# Altium schematic sheet RowSingle.SchDoc
size A
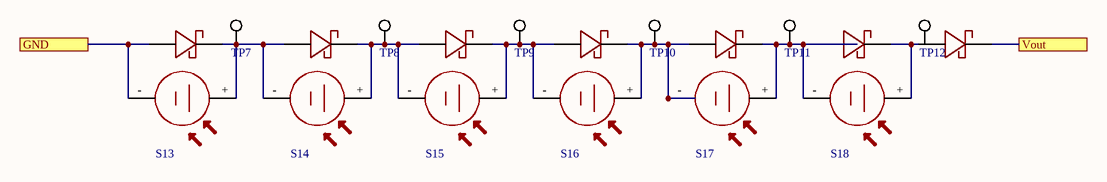
[diagram p0: RowSingle.SchDoc]

## Parts
D8  SCHOTTKY_DIODE_B120-FDICT-NDSCHOTTKY_DIODE_B120-FDICT-ND  [SB_DIODE]  (value not drawn)
D9  SCHOTTKY_DIODE_B120-FDICT-NDSCHOTTKY_DIODE_B120-FDICT-ND  [SB_DIODE]  (value not drawn)
D10  SCHOTTKY_DIODE_B120-FDICT-NDSCHOTTKY_DIODE_B120-FDICT-ND  [SB_DIODE]  (value not drawn)
D11  SCHOTTKY_DIODE_B120-FDICT-NDSCHOTTKY_DIODE_B120-FDICT-ND  [SB_DIODE]  (value not drawn)
D12  SCHOTTKY_DIODE_B120-FDICT-NDSCHOTTKY_DIODE_B120-FDICT-ND  [SB_DIODE]  (value not drawn)
D13  SCHOTTKY_DIODE_B120-FDICT-NDSCHOTTKY_DIODE_B120-FDICT-ND  [SB_DIODE]  (value not drawn)
D14  SCHOTTKY_DIODE_B120-FDICT-NDSCHOTTKY_DIODE_B120-FDICT-ND  [SB_DIODE]  (value not drawn)
S13  SOLAR_CELL  [SOLAR_CELL]  (value not drawn)
S14  SOLAR_CELL  [SOLAR_CELL]  (value not drawn)
S15  SOLAR_CELL  [SOLAR_CELL]  (value not drawn)
S16  SOLAR_CELL  [SOLAR_CELL]  (value not drawn)
S17  SOLAR_CELL  [SOLAR_CELL]  (value not drawn)
S18  SOLAR_CELL  [SOLAR_CELL]  (value not drawn)
TP7  TEST_POINT  [TEST_POINT]  (value not drawn)
TP8  TEST_POINT  [TEST_POINT]  (value not drawn)
TP9  TEST_POINT  [TEST_POINT]  (value not drawn)
TP10  TEST_POINT  [TEST_POINT]  (value not drawn)
TP11  TEST_POINT  [TEST_POINT]  (value not drawn)
TP12  TEST_POINT  [TEST_POINT]  (value not drawn)

## Ports
GND, Vout

## Nets
GND: D8.POS S13.- ; port GND
Vout: D14.NEG ; port Vout
NetD8_NEG: D8.NEG D9.POS S13.+ S14.- TP7.38
NetD9_NEG: D9.NEG D10.POS S14.+ S15.- TP8.38
NetD10_NEG: D10.NEG D11.POS S15.+ S16.- TP9.38
NetD11_NEG: D11.NEG D12.POS S16.+ S17.- TP10.38
NetD12_NEG: D12.NEG S17.+ S18.- TP11.38
NetD13_NEG: D13.NEG D14.POS S18.+

Not connected (* = marked no-connect by the designer): TP12 38

## Library data of the parts
D8-D14 = SCHOTTKY_DIODE_B120-FDICT-NDSCHOTTKY_DIODE_B120-FDICT-ND: GateName_1: G$1; SymbolName_1: SCHOTTKY_DIODE_B120-FDICT-ND; DeviceName: SCHOTTKY_DIODE_B120-FDICT-ND; LibraryName: Solar_Fadi; DeviceSetName: SCHOTTKY_DIODE_B120-FDICT-ND; Package: SCHOTTKY_DIODE_B120-FDICT-ND
TP7-TP12 = TEST_POINT: pin to pad: 38>PAD